# Altium schematic sheet Block_diagram_page.SchDoc
size A3; SheetNumber: 2; SheetTotal: 5
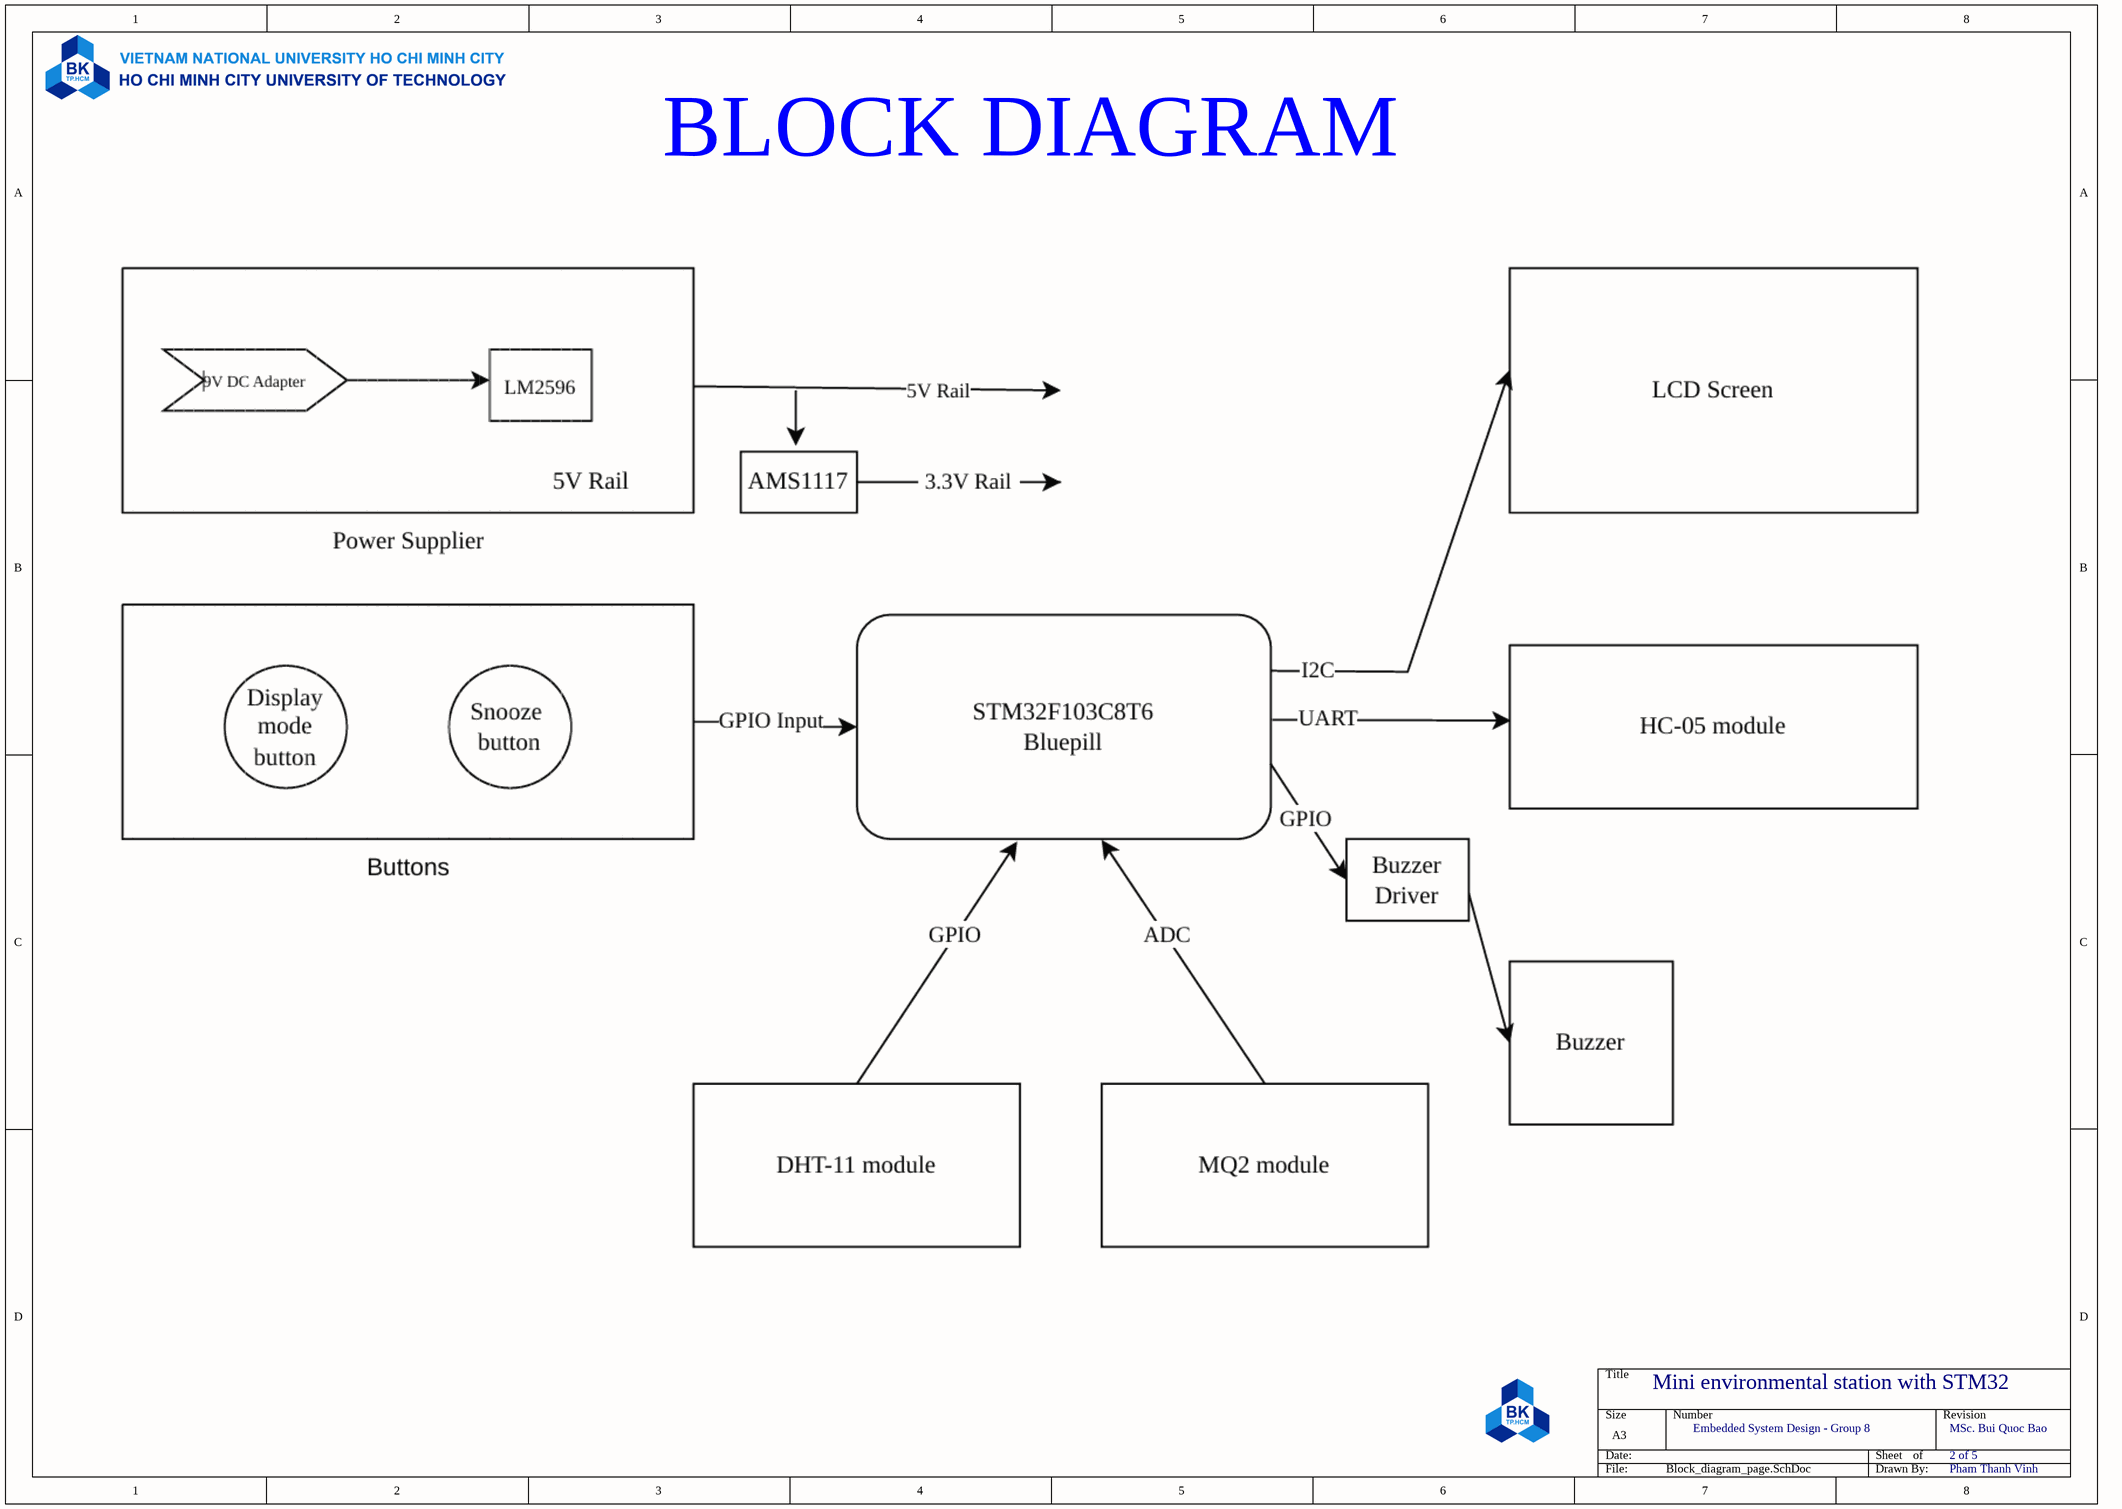
[diagram p0: Block_diagram_page.SchDoc]

## Notes on the sheet
- BLOCK DIAGRAM
- Mini environmental station with STM32
- Embedded System Design - Group 8
- MSc. Bui Quoc Bao
- 2 of 5
- Pham Thanh Vinh